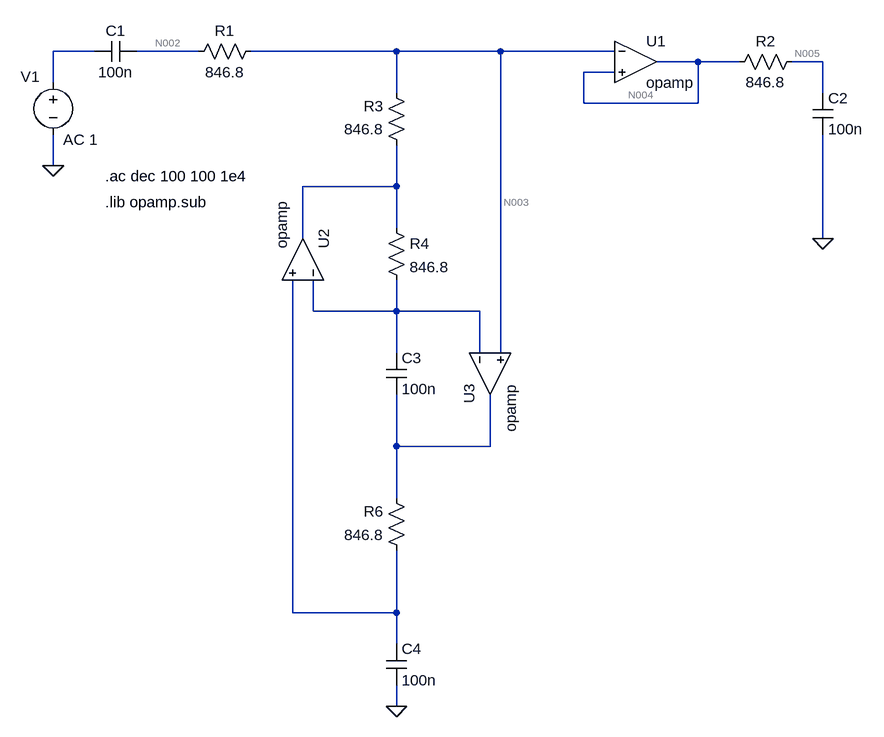
[diagram p0: schematic TS3_act.asc]
TS3_act.asc, the LTspice schematic file:
Version 4
SHEET 1 880 680
WIRE -1088 -784 -1152 -784
WIRE -928 -784 -1024 -784
WIRE -624 -784 -848 -784
WIRE -464 -784 -624 -784
WIRE -288 -784 -464 -784
WIRE -160 -768 -224 -768
WIRE -96 -768 -160 -768
WIRE 32 -768 -16 -768
WIRE -288 -752 -336 -752
WIRE -1152 -736 -1152 -784
WIRE -624 -720 -624 -784
WIRE 32 -720 32 -768
WIRE -336 -704 -336 -752
WIRE -160 -704 -160 -768
WIRE -160 -704 -336 -704
WIRE -1152 -608 -1152 -656
WIRE -624 -576 -624 -640
WIRE -624 -576 -768 -576
WIRE -624 -512 -624 -576
WIRE -768 -496 -768 -576
WIRE 32 -496 32 -656
WIRE -752 -384 -752 -432
WIRE -624 -384 -624 -432
WIRE -624 -384 -752 -384
WIRE -496 -384 -624 -384
WIRE -624 -320 -624 -384
WIRE -496 -320 -496 -384
WIRE -464 -320 -464 -784
WIRE -624 -176 -624 -256
WIRE -480 -176 -480 -256
WIRE -480 -176 -624 -176
WIRE -624 -96 -624 -176
WIRE -784 80 -784 -432
WIRE -624 80 -624 -16
WIRE -624 80 -784 80
WIRE -624 128 -624 80
WIRE -624 224 -624 192
FLAG -624 224 0
FLAG -1152 -608 0
FLAG 32 -496 0
SYMBOL Opamps\\opamp -256 -832 R0
SYMATTR InstName U1
SYMBOL res 0 -784 R90
WINDOW 0 0 56 VBottom 2
WINDOW 3 32 56 VTop 2
SYMATTR InstName R2
SYMATTR Value 846.8
SYMBOL cap 16 -720 R0
SYMATTR InstName C2
SYMATTR Value 100n
SYMBOL voltage -1152 -752 R0
WINDOW 0 -50 7 Left 2
WINDOW 123 15 104 Left 2
WINDOW 39 0 0 Left 2
SYMATTR InstName V1
SYMATTR Value2 AC 1
SYMATTR Value ""
SYMBOL cap -1024 -800 R90
WINDOW 0 0 32 VBottom 2
WINDOW 3 32 32 VTop 2
SYMATTR InstName C1
SYMATTR Value 100n
SYMBOL res -832 -800 R90
WINDOW 0 0 56 VBottom 2
WINDOW 3 32 56 VTop 2
SYMATTR InstName R1
SYMATTR Value 846.8
SYMBOL res -608 -624 R180
WINDOW 0 36 76 Left 2
WINDOW 3 36 40 Left 2
SYMATTR InstName R3
SYMATTR Value 846.8
SYMBOL Opamps\\opamp -704 -464 M270
SYMATTR InstName U2
SYMBOL Opamps\\opamp -544 -288 M90
SYMATTR InstName U3
SYMBOL res -608 0 R180
WINDOW 0 36 76 Left 2
WINDOW 3 36 40 Left 2
SYMATTR InstName R6
SYMATTR Value 846.8
SYMBOL res -640 -528 R0
SYMATTR InstName R4
SYMATTR Value 846.8
SYMBOL cap -640 -320 R0
SYMATTR InstName C3
SYMATTR Value 100n
SYMBOL cap -640 128 R0
SYMATTR InstName C4
SYMATTR Value 100n
TEXT -1072 -592 Left 2 !.ac dec 100 100 1e4
TEXT -1072 -552 Left 2 !.lib opamp.sub

The netlist it stands for:
* TS3_act.asc
XU1 N003 N004 N004 opamp Aol=100K GBW=10Meg  ; pins invin noninvin out
R2 N005 N004 846.8
C2 N005 0 100n
V1 N001 0 AC 1
C1 N002 N001 100n
R1 N003 N002 846.8
R3 N006 N003 846.8
XU2 N007 N009 N006 opamp Aol=100K GBW=10Meg  ; pins invin noninvin out
XU3 N007 N003 N008 opamp Aol=100K GBW=10Meg  ; pins invin noninvin out
R6 N009 N008 846.8
R4 N006 N007 846.8
C3 N007 N008 100n
C4 N009 0 100n
.ac dec 100 100 1e4
.lib opamp.sub
.backanno
.end

* Results of the author's LTspice run, read from the files saved beside the schematic
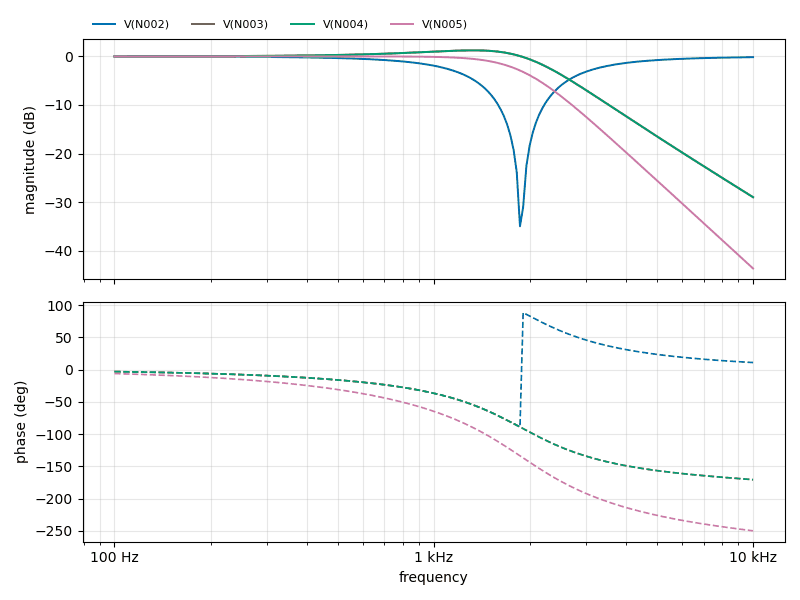
[diagram p1: AC Analysis of TS3_act.asc, plotted from the saved traces]
* AC Analysis, 1 run:
*   V(N002): -0.01 dB at 100 Hz, -0.16 dB at 10 kHz, peak -0.01 dB at 100 Hz, 3 dB below the peak at 1.162 kHz
*   V(N003): 0.01 dB at 100 Hz, -28.98 dB at 10 kHz, peak 1.25 dB at 1.318 kHz, 3 dB below the peak at 2.196 kHz
*   V(N004): 0.01 dB at 100 Hz, -28.98 dB at 10 kHz, peak 1.25 dB at 1.318 kHz, 3 dB below the peak at 2.196 kHz
*   V(N005): -0.00 dB at 100 Hz, -43.65 dB at 10 kHz, peak -0.00 dB at 100 Hz, 3 dB below the peak at 1.878 kHz